# EAGLE design sandwich_tb55_5 (EAGLE 5.10)
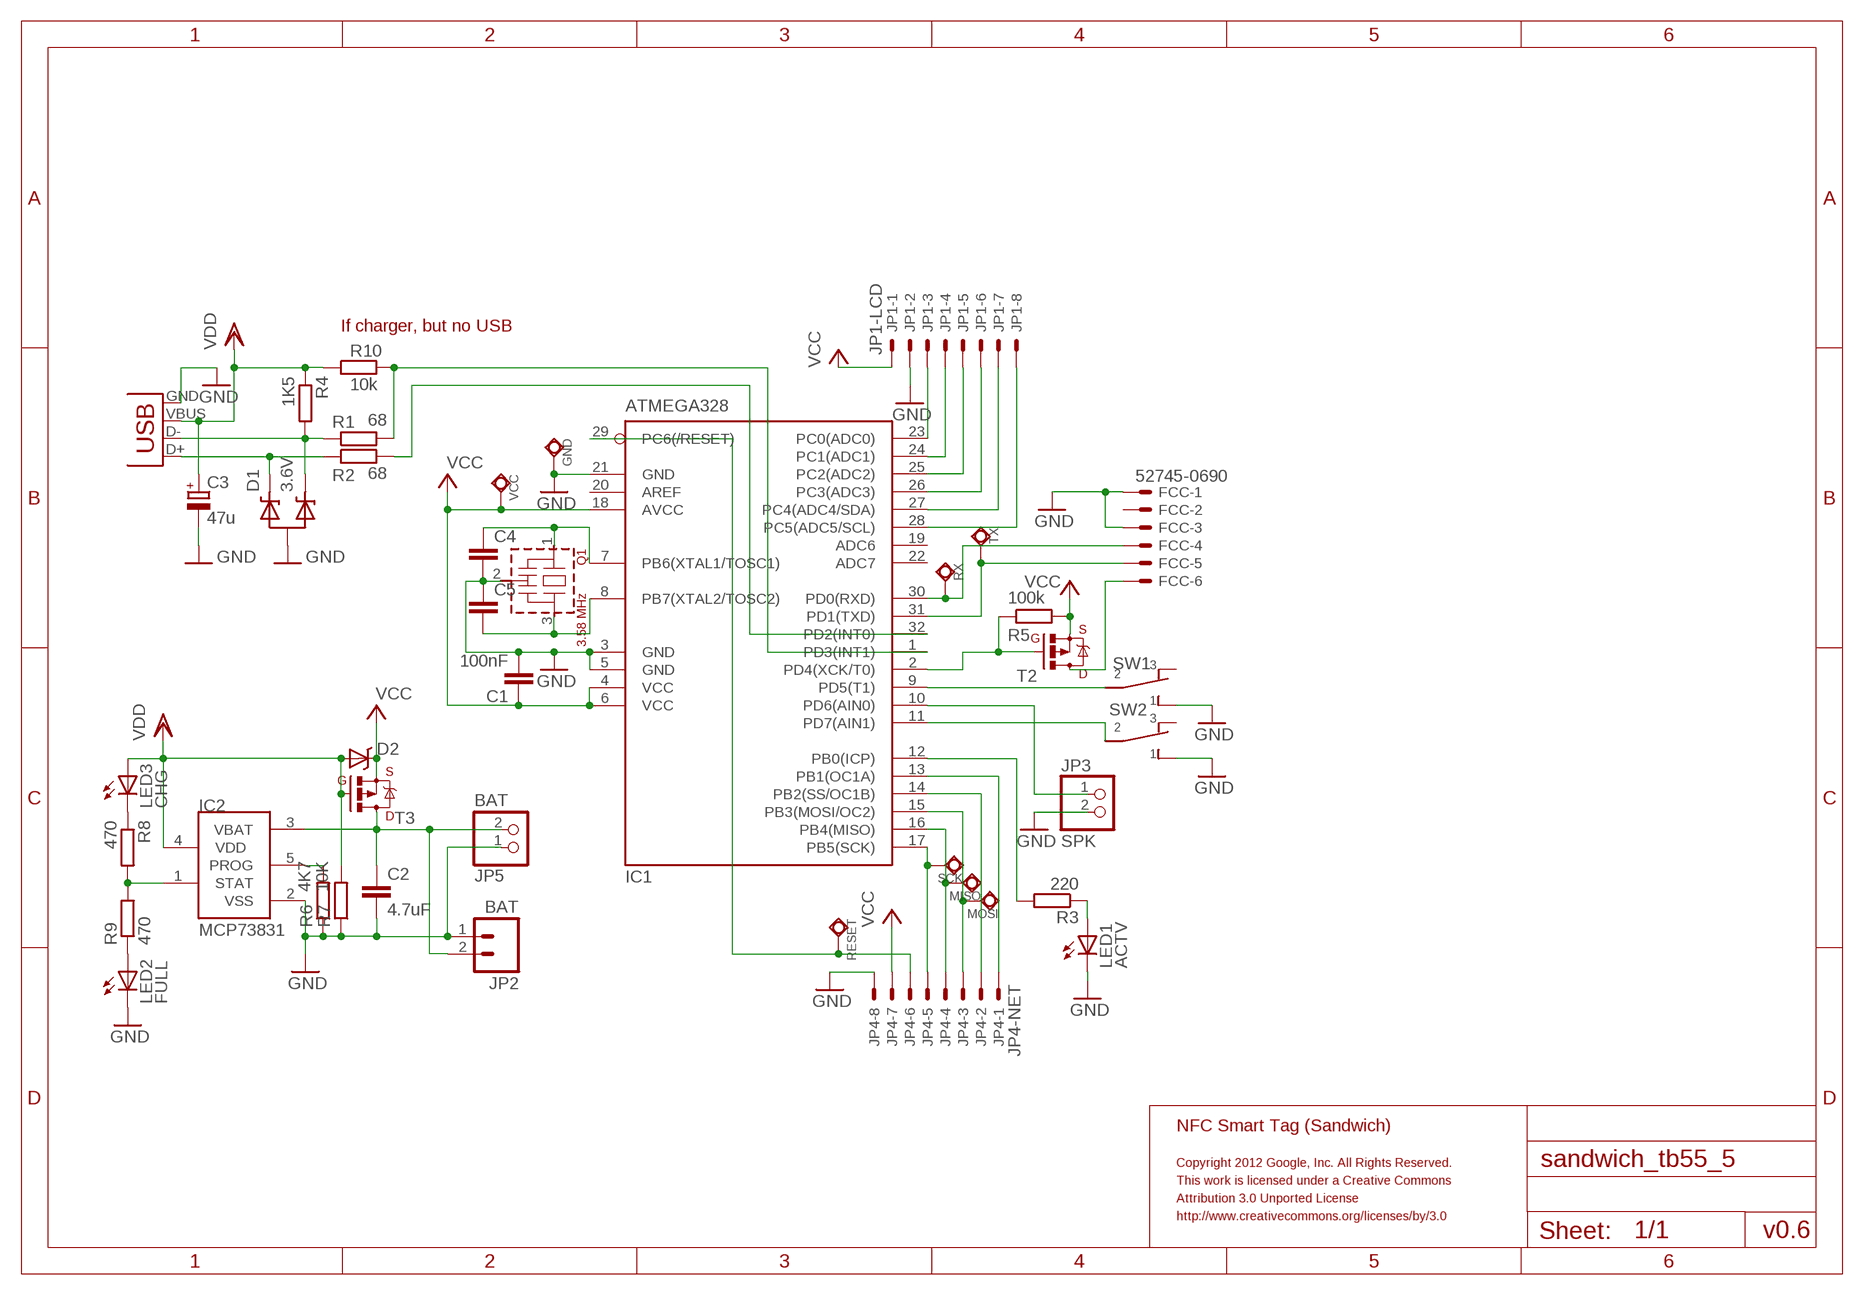
[diagram p0: schematic, sheet 1]

## Parts
C1  100nF  CAP0805  [0805]
C2  4.7uF  C-EUC0805  [C0805]
C3  47u  CPOL-EUCT6032  [CT6032]
C4  CAP0603-CAP  [0603-CAP]
C5  CAP0603-CAP  [0603-CAP]
D1  3.6V  DIODE-ZENER-DUAL-COMMON-ANODE  [SOT23]
D2  DIODE-SCHOTTKY  [MCPH3]
FCC  52745-0690  [52745-0690]
GND  TESTPOINT-BOTTOM  [TP_BOTTOM]
IC1  ATMEGA328  MEGA8-AI  [TQFP32-08]
IC2  MCP73831  [SOT23-5L]
JP1  JP1-LCD  53261-08  [53261-08]
JP2  BAT  M02-JST-2MM-SMT  [S2B-PH]
JP3  SPK  PINHD-1X2  [1X02]
JP4  JP4-NET  53261-08  [53261-08]
JP5  BAT  PINHD-1X2  [1X02]
LED1  ACTV  LEDCHIP-LED0805  [CHIP-LED0805]
LED2  FULL  LEDCHIP-LED0805  [CHIP-LED0805]
LED3  CHG  LEDCHIP-LED0805  [CHIP-LED0805]
MISO  TESTPOINT-BOTTOM  [TP_BOTTOM]
MOSI  TESTPOINT-BOTTOM  [TP_BOTTOM]
Q1  3.58 MHz  CTSC  [CSTCC_MG]
R1  68  R-EU_R0805  [R0805]
R2  68  R-EU_R0805  [R0805]
R3  220  R-EU_R0805  [R0805]
R4  1K5  R-EU_R0805  [R0805]
R5  100k  R-EU_R0805  [R0805]
R6  4K7  R-EU_R0805  [R0805]
R7  10K  R-EU_R0805  [R0805]
R8  470  R-EU_R0805  [R0805]
R9  470  R-EU_R0805  [R0805]
R10  10k  R-EU_R0805  [R0805]
RESET  TESTPOINT-BOTTOM  [TP_BOTTOM]
RX  TESTPOINT-BOTTOM  [TP_BOTTOM]
SCK  TESTPOINT-BOTTOM  [TP_BOTTOM]
SW1  SWITCH-CUS-12B  [CUS-12B]
SW2  SWITCH-CUS-12B  [CUS-12B]
T2  MOSFET-PCHANNEL  [SOT23]
T3  MOSFET-PCHANNEL  [SOT23]
TX  TESTPOINT-BOTTOM  [TP_BOTTOM]
USB  USB-MICROB  [USB-MICROB]
VCC  TESTPOINT-BOTTOM  [TP_BOTTOM]

## Nets
D+: D1.2(C2) R2.1 USB.D+
D-: D1.1(C1) R1.1 R4.2 USB.D-
GND: C1.2 C2.2 C3.- C4.2 C5.1 D1.3(A) FCC.1 FCC.3 GND.TP IC1.3(GND) IC1.5(GND) IC1.21(GND) IC2.2(VSS) JP1.2 JP2.1 JP3.2 JP4.8 JP5.1 LED1.C LED2.C Q1.2(VSS) R6.1 R7.1 SW1.1 SW2.1 USB.GND
N$1: LED3.C R8.1
N$2: LED2.A R9.1
N$7: LED1.A R3.1
NFC_VCC: FCC.6 T2.3(D)
PB0: IC1.12(PB0(ICP)) R3.2
PB1: IC1.13(PB1(OC1A)) JP4.1
PB2: IC1.14(PB2(SS/OC1B)) JP4.2
PB3: IC1.15(PB3(MOSI/OC2)) JP4.3 MOSI.TP
PB4: IC1.16(PB4(MISO)) JP4.4 MISO.TP
PB5: IC1.17(PB5(SCK)) JP4.5 SCK.TP
PC0: IC1.23(PC0(ADC0)) JP1.3
PC1: IC1.24(PC1(ADC1)) JP1.4
PC2: IC1.25(PC2(ADC2)) JP1.5
PC3: IC1.26(PC3(ADC3)) JP1.6
PC4: IC1.27(PC4(ADC4/SDA)) JP1.7
PC5: IC1.28(PC5(ADC5/SCL)) JP1.8
PD2: IC1.32(PD2(INT0)) R2.2
PD3: IC1.1(PD3(INT1)) R1.2 R10.2
PD4: IC1.2(PD4(XCK/T0)) R5.1 T2.1(G)
PD5: IC1.9(PD5(T1)) SW1.2
PD6: IC1.10(PD6(AIN0)) JP3.1
PD7: IC1.11(PD7(AIN1)) SW2.2
PROG: IC2.5(PROG) R6.2
RESET: IC1.29(PC6(/RESET)) JP4.6 RESET.TP
RX: FCC.4 IC1.30(PD0(RXD)) RX.TP
STAT: IC2.1(STAT) R8.2 R9.2
TX: FCC.5 IC1.31(PD1(TXD)) TX.TP
VBAT: C2.1 IC2.3(VBAT) JP2.2 JP5.2 T3.3(D)
VCC: C1.1 D2.3(C) IC1.4(VCC) IC1.6(VCC) IC1.18(AVCC) JP1.1 JP4.7 R5.2 T2.2(S) T3.2(S) VCC.TP
VDD: C3.+ D2.1(A) IC2.4(VDD) LED3.A R4.1 R7.2 R10.1 T3.1(G) USB.VBUS
XTAL1: C4.1 IC1.7(PB6(XTAL1/TOSC1)) Q1.1
XTAL2: C5.2 IC1.8(PB7(XTAL2/TOSC2)) Q1.3
Unconnected: FCC.2 IC1.19(ADC6) IC1.20(AREF) IC1.22(ADC7) SW1.3 SW2.3

## Notes on the sheet
- If charger, but no USB
- NFC Smart Tag (Sandwich)
- Copyright 2012 Google, Inc. All Rights Reserved.
- This work is licensed under a Creative Commons
- Attribution 3.0 Unported License
- http://www.creativecommons.org/licenses/by/3.0
- v0.6

## Library data of the parts
C1 C4 C5 = SparkFun:CAP: Capacitor Standard 0603 ceramic capacitor, and 0.1" leaded capacitor.
C2 = resistor:C-EU: CAPACITOR, European symbol
C3 = rcl:CPOL-EU: POLARIZED CAPACITOR, European symbol
D1 = sandwich:DIODE-ZENER-DUAL-COMMON-ANODE: Dual Zener diode in SOT-23 Package. e.g. AZ23C
D2 = sandwich:DIODE-SCHOTTKY
FCC = con-molex:52745-0690: FFC/FPC-to-Board 0.50mm (.020") SMT Top Contact Right Angle, ZIF, Style Receptacle 52745 / 52435 Source: http://www.molex.com/product/ffc/52745.html; MPN: 52745-0690; OC_FARNELL: unknown; OC_NEWARK: 92M6374
GND MISO MOSI RESET RX SCK TX VCC = sandwich:TESTPOINT-BOTTOM: Round test point on bototm layer. 1.5mm diameter
IC1 = atmel:MEGA8: MICROCONTROLLER 8 Kbytes FLASH, 1 kbytes SRAM, 512 bytes EEPROM, USART, 6-channel 10 bit ADC, 2-channel 8 bit ADC Pin compatible with Atmega48, ATMega88, ATMega168 Source: avr.lbr; MPN: ATMEGA8-16AU; OC_FARNELL: 9171371; OC_NEWARK: 73M8863
IC2 = microchip-update-2:MCP73831: Miniature Single-Cell, Fully Integrated Li-Ion, Li-Polymer Charge Management Controllers
JP1 JP4 = con-molex:53?-08: CONNECTOR wire to board 1.25 mm (.049 inch) pitch header; OC_FARNELL: 1125376; OC_NEWARK: unknown
JP2 = SparkFun:M02: Header 2 Standard 2-pin 0.1" header. Use with straight break away headers (SKU : PRT-00116), right angle break away headers (PRT-00553), swiss pins (PRT-00743), machine pins (PRT-00117), and female headers (PRT-00115). Molex polarized connector foot print use with SKU : PRT-08233 with associated crimp pins and housings.
JP3 JP5 = pinhead:PINHD-1X2: PIN HEADER
LED1-LED3 = led:LED: LED OSRAM: - CHIPLED LG R971, LG N971, LY N971, LG Q971, LY Q971, LO R971, LY R971 LH N974, LH R974 LS Q976, LO Q976, LY Q976 LO Q996 - Hyper CHIPLED LW Q18S LB Q993, LB Q99A, LB R99A - SideLED LS A670, LO A670, LY A670, LG A670, LP A670 LB A673, LV A673, LT A673, LW A673 LH A674 LY A675 LS A676, LA A676, LO A676, LY A676, LW A676 LS A679, LY A679, LG A679 - Hyper Micro SIDELED® LS Y876, LA Y876, LO Y876, LY Y876 LT Y87S - SmartLED LW L88C, LW L88S LB L89C, LB L89S, LG L890 LS L89K, LO L89K, LY L89K LS L896, LA L896, LO L896, LY L896 - TOPLED LS T670, LO T670, LY T670, LG T670, LP T670 LSG T670, LSP T670, LSY T670, LOP T670, LYG T670 LG T671, LOG T671, LSG T671 LB T673, LV T673, LT T673, LW T673 LH T674 LS T676, LA T676, LO T676, LY T676, LB T676, LH T676, LSB T676, LW T676 LB T67C, LV T67C, LT T67C, LS T67K, LO T67K, LY T67K, LW E67C LS E67B, LA E67B, LO E67B, LY E67B, LB E67C, LV E67C, LT E67C LW T67C LS T679, LY T679, LG T679 LS T770, LO T770, LY T770, LG T770, LP T770 LB T773, LV T773, LT T773, LW T773 LH T774 LS E675, LA E675, LY E675, LS T675 LS T776, LA T776, LO T776, LY T776, LB T776 LHGB T686 LT T68C, LB T68C - Hyper Mini TOPLED® LB M676 - Mini TOPLED Santana® LG M470 LS M47K, LO M47K, LY M47K Source: http://www.osram.convergy.de LUXEON: - LUMILED® LXK2-PW12-R00, LXK2-PW12-S00, LXK2-PW14-U00, LXK2-PW14-V00 LXK2-PM12-R00, LXK2-PM12-S00, LXK2-PM14-U00 LXK2-PE12-Q00, LXK2-PE12-R00, LXK2-PE12-S00, LXK2-PE14-T00, LXK2-PE14-U00 LXK2-PB12-K00, LXK2-PB12-L00, LXK2-PB12-M00, LXK2-PB14-N00, LXK2-PB14-P00, LXK2-PB14-Q00 LXK2-PR12-L00, LXK2-PR12-M00, LXK2-PR14-Q00, LXK2-PR14-R00 LXK2-PD12-Q00, LXK2-PD12-R00, LXK2-PD12-S00 LXK2-PH12-R00, LXK2-PH12-S00 LXK2-PL12-P00, LXK2-PL12-Q00, LXK2-PL12-R00 Source: www.luxeon.com KINGBRIGHT: KA-3528ASYC Source: www.kingbright.com
Q1 = murata-resonators:CTSC: Murata Resonator 3.50 - 10.00MHz
R1-R10 = resistor:R-EU_: RESISTOR, European symbol
SW1 SW2 = sandwich:SWITCH-CUS-12B: CUS-12B 1P2T SMD Switch RS Part 602-3633
T2 T3 = sandwich:MOSFET-PCHANNEL: E.g. IRLML6402
USB = sandwich:USB: USB Connectors USB-B-PTH is fully proven SKU : PRT-00139 USB-miniB is fully proven SKU : PRT-00587 USB-A-PCB is untested. USB-A-H is throughly reviewed, but untested. Spark Fun Electronics SKU : PRT-00437 USB-B-SMT is throughly reviewed, but untested. Needs silkscreen touching up. USB-A-S has not been used/tested USB-MB-H has not been used/tested

## Board
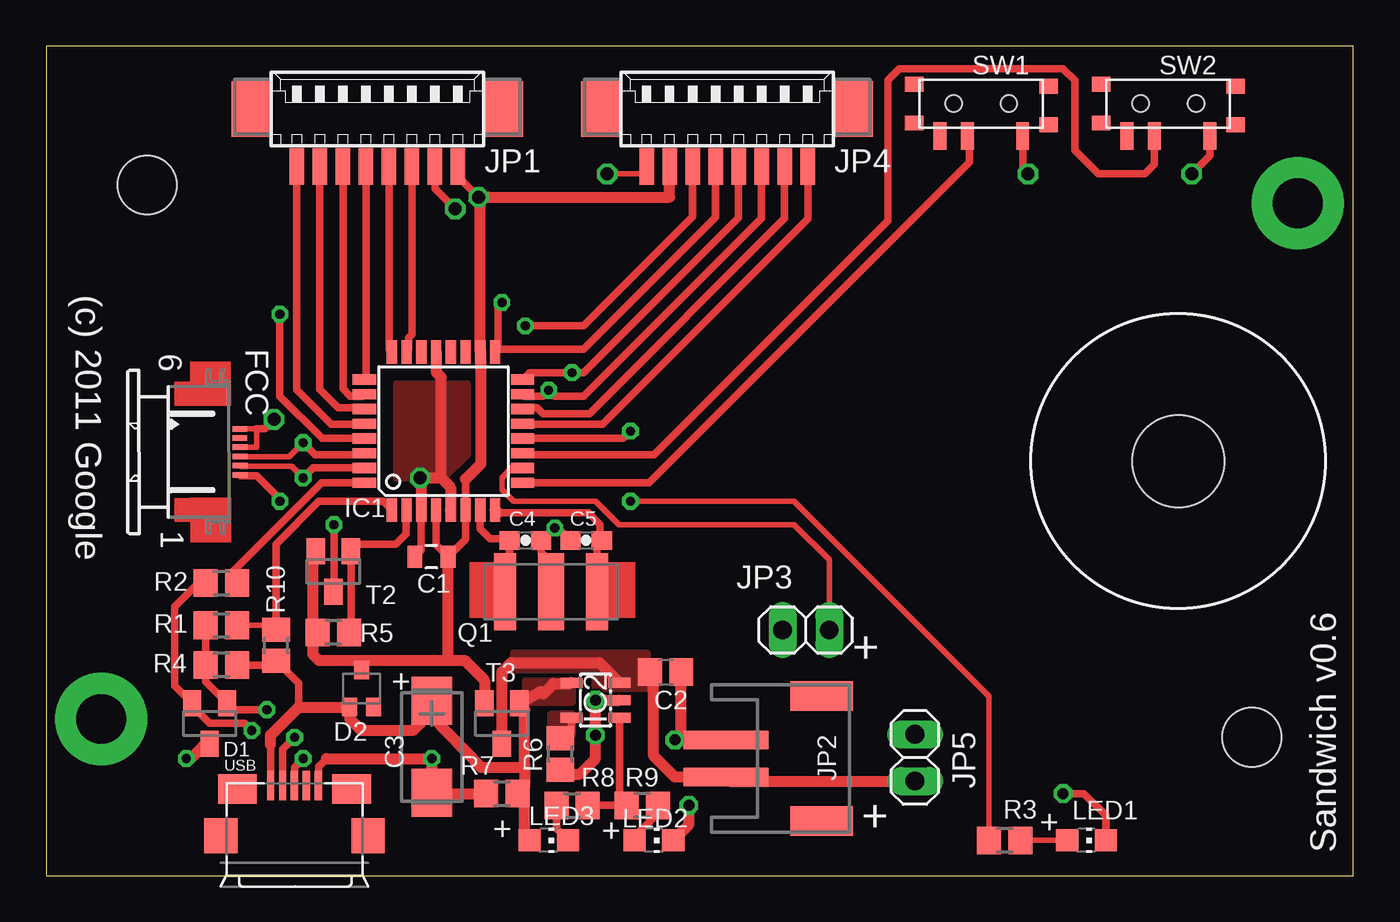
[diagram p1: board, top side]
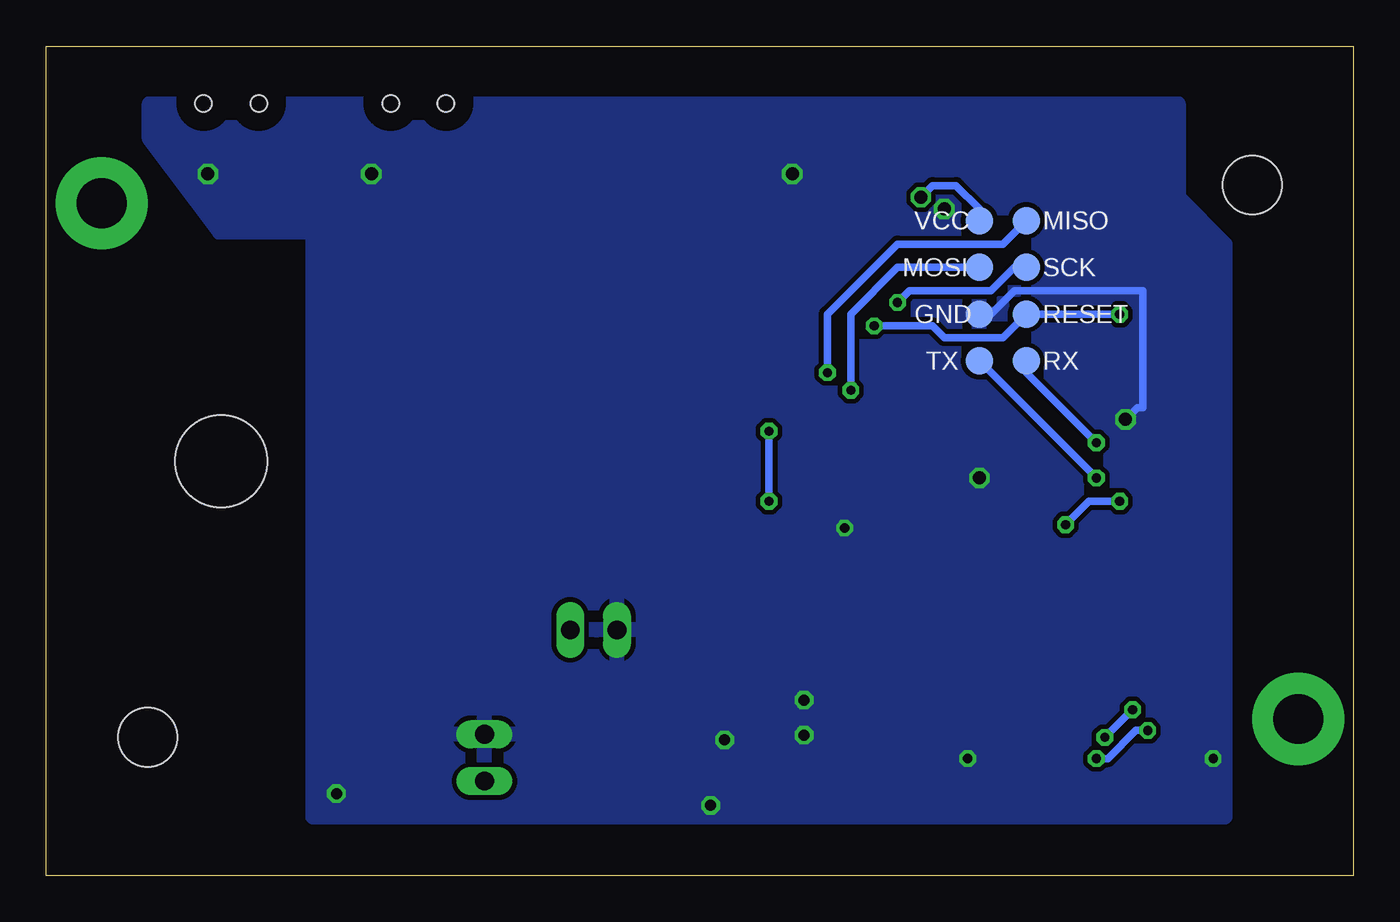
[diagram p2: board, bottom side, seen from below]

Size 71.02 x 45.04 mm. Coordinates in mm from the lower left corner, seen from the top.
Outline: 0,0 71.02,0 71.02,45.04 0,45.04 0,0
Copper layers (1*16): Top 0.035mm / dielectric 1.5mm / Bottom 0.035mm
Design rules "default *": minimum track width 0.3mm, minimum drill 19mil, track to track 5mil, track to pad 5mil, pad to pad 5mil, via to via 5mil, smd to smd 5mil, copper to edge 40mil, drill to drill 5mil, minimum pad ring 10mil, minimum via ring 8mil, stop-mask expansion 4mil, vias tented up to drill 0.5mm, thermal gap 10mil
Holes 3.2 mm at 5.5,37.5 65.5,7.5
Holes 5 mm at 61.5,22.5

### Footprints (pad centres in the part's own frame; a part is rotated, then mirrored left to right if it is on the bottom)
0805 = smd 0.8 x 1.2: 1 -0.9,0; 2 0.9,0
C0805 = smd 1.3 x 1.5: 1 -0.85,0; 2 0.85,0
CT6032 = smd 2.6 x 2.2: + -2.5,0; - 2.5,0
0603-CAP = smd 1.1 x 1: 1 -0.85,0; 2 0.85,0
SOT23 = smd 1 x 1.4: 1 -0.95,-1.1; 2 0.95,-1.1; 3 0,1.1
MCPH3 = smd 0.8 x 1: 1 -0.65,-1; 2 0.65,-1; 3 0,1
52745-0690 = smd 0.3 x 0.8: 1 -1.25,2.5; 2 -0.75,2.5; 3 -0.25,2.5; 4 0.25,2.5; 5 0.75,2.5; 6 1.25,2.5
TP_BOTTOM = smd 1.5 x 1.5 bottom: TP 0,0
TQFP32-08 = smd 1.27 x 0.559: 1 -4.293,2.8; 2 -4.293,2; 3 -4.293,1.2; 4 -4.293,0.4; 5 -4.293,-0.4; 6 -4.293,-1.2; 7 -4.293,-2; 8 -4.293,-2.8; 17 4.293,-2.8; 18 4.293,-2; 19 4.293,-1.2; 20 4.293,-0.4; 21 4.293,0.4; 22 4.293,1.2; 23 4.293,2; 24 4.293,2.8 | smd 0.559 x 1.27: 9 -2.8,-4.293; 10 -2,-4.293; 11 -1.2,-4.293; 12 -0.4,-4.293; 13 0.4,-4.293; 14 1.2,-4.293; 15 2,-4.293; 16 2.8,-4.293; 25 2.8,4.293; 26 2,4.293; 27 1.2,4.293; 28 0.4,4.293; 29 -0.4,4.293; 30 -1.2,4.293; 31 -2,4.293; 32 -2.8,4.293
SOT23-5L = smd 0.55 x 1.2: 1 -0.95,-1.3; 2 0,-1.3; 3 0.95,-1.3; 4 0.95,1.3; 5 -0.95,1.3
53261-08 = smd 0.8 x 2: 1 4.375,-2.5; 2 3.125,-2.5; 3 1.875,-2.5; 4 0.625,-2.5; 5 -0.625,-2.5; 6 -1.875,-2.5; 7 -3.125,-2.5; 8 -4.375,-2.5 | smd 2.1 x 3: S1 6.875,0.625; S2 -6.875,0.625
S2B-PH = smd 1 x 4.6: 1 -1,-3.7; 2 1,-3.7 | smd 1.6 x 3.4: NC1 -3.4,1.5; NC2 3.4,1.5
1X02 = drill 1.016 long: 1 -1.27,0; 2 1.27,0
CHIP-LED0805 = smd 1.2 x 1.2: A 0,-1.05; C 0,1.05
CSTCC_MG = smd 1.2 x 4.2: 1 -2.5,0; 3 2.5,0 | smd 1.4 x 4.2: 2 0,0
R0805 = smd 1.3 x 1.5: 1 -0.85,0; 2 0.85,0
CUS-12B = smd 0.7 x 1.5: 1 -2.25,1.75; 2 0.75,1.75; 3 2.25,1.75 | smd 1 x 0.8: P$1 3.65,1.05; P$2 3.65,-1.05; P$3 -3.65,1.15; P$4 -3.65,-0.95 | hole 0.9: 1.5,0; -1.5,0
USB-MICROB = smd 0.4 x 1.6: D+ 0,2.9; D- -0.65,2.9; GND 1.3,2.9; ID 0.65,2.9; VBUS -1.3,2.9 | smd 2.1 x 1.6: GND@1 3.1,2.7; GND@4 -3.1,2.7 | smd 1.8 x 1.9: GND@2 -4,0.15; GND@3 4,0.15

### Placement (x,y rotation side)
C1  20.93,17.31 180 top
C2  33.66,11.05 0 top
C3  20.95,6.99 270 top
C4  26.04,18.2 0 top
C5  29.34,18.2 0 top
D1  8.89,8.26 180 top
D2  17.14,10.16 0 top
FCC  8.04,23 270.1 top
GND  20.32,30.48 0 top
IC1  21.59,24.13 90 top
IC2  29.84,9.53 90 top
JP1  18,41 0 top
JP2  40.64,6.35 270 top
JP3  41.27,13.34 180 top
JP4  37,41 0 top
JP5  47.2,6.4 270 top
LED1  56.52,1.91 270 top
LED2  33.02,1.91 270 top
LED3  27.3,1.91 270 top
MISO  17.78,35.56 0 top
MOSI  20.32,33.02 0 top
Q1  27.43,15.4 0 top
R1  9.53,13.59 0 top
R2  9.53,15.88 0 top
R3  52.07,1.91 180 top
R4  9.53,11.43 180 top
R5  15.61,13.2 180 top
R6  27.94,6.6 90 top
R7  24.77,4.45 0 top
R8  28.57,3.81 0 top
R9  32.38,3.81 180 top
R10  12.5,12.5 90 top
RESET  17.78,30.48 0 top
RX  17.78,27.94 0 top
SCK  17.78,33.02 0 top
SW1  50.8,41.91 180 top
SW2  60.96,41.91 180 top
T2  15.61,16.51 180 top
T3  24.77,8.26 180 top
TX  20.32,27.94 0 top
USB  13.5,2 0 top
VCC  20.32,35.56 0 top

### Tracks (layer width: path | path; a pad name or v marks a point on that pad's centre or on a via)
D+  (via drill 0.5, 0.5 pad 0.41)
  Top 0.406: USB.D+ 13.5,5.88 v13.97,6.35 | R2.1 8.26,15.88 6.99,14.61 6.99,10.31 D1.2 7.94,9.21 8.89,8.26 10.79,8.26 v11.18,7.87
  Bottom 0.406: v11.18,7.87 11.81,7.87 13.34,6.35 v13.97,6.35
D-  (via drill 0.5)
  Top 0.406: R1.1 R4.2 8.68,10.52 D1.1 10.2,9 v12,9 | USB.D- 12.85,6.85 v13.5,7.5
  Bottom 0.406: v12,9 v13.5,7.5
GND  (via drill 0.5, 0.6, 0.7)
  Top 0.305: FCC.1 11.45,24.25 11.45,23.25 FCC.3 | JP4.8 32.62,38.34 32.38,38.1 v30.48,38.1
  Top 0.406: SW1.1 53.05,38.39 v53.34,38.1 | SW2.1 63.21,39.08 v62.23,38.1 | 20.39,21.52 v20.32,21.59 | 21.97,19.86 IC1.5 | JP1.2 21.12,37.3 v22.23,36.2 | 11.45,24.25 11.87,24.25 v12.38,24.77 | IC1.3 20.38,19.77 20.38,17.66 C1.2 | USB.GND 14.8,5.91 15.24,6.35 | 20.95,5.08 21.17,5.29 | LED1.C 57.56,3.27 56.39,4.45 v55.24,4.45 | 28.41,18.29 C5.1 27.83,18.87 v27.64,18.87 27.09,18.32 27,18.32 C4.2 26.89,17.57 27.94,16.51 27.94,15.91 Q1.2
  Top 0.61: IC1.3 20.39,21.52 | v20.32,21.59 21.46,21.59 | 21.46,21.59 21.97,21.08 21.97,19.86 | 21.46,21.59 21.46,27.05 21.21,27.3 21.21,28.4 IC1.21 | 15.24,6.35 v20.95,6.35 20.95,5.08 C3.- 21,4.45 R7.1 | IC2.2 v29.84,9.53 v29.84,7.62 29.84,6.34 29,5.5 28.19,5.5 R6.1 | 34.18,7.35 JP2.1 | C2.2 34.51,7.71 v34.16,7.37 | v7.62,6.35 7.85,6.35 8.5,7 8.73,7 D1.3 | v34.92,3.81 34.92,2.76 LED2.C
  Top 0.813: v34.16,7.37 34.18,7.35
  Bottom 0.406: GND.TP 19.68,30.48 18.41,31.75 11.43,31.75 11.43,25.4 11.75,25.4 v12.38,24.77
  pour Bottom (isolate 0.254): 56.52,3.17 56.52,34.92 61.59,34.92 65.41,40.01 65.41,41.91 9.53,41.91 9.53,36.83 6.99,34.29 6.99,3.17
  pour Top: 19.05,26.67 22.86,26.67 22.86,22.86 21.59,21.59 19.05,21.59
N$1
  Top 0.406: R8.1 27.73,2.54 LED3.C
N$2
  Top 0.406: LED2.A 31.97,2.12 33.02,3.17 33.02,3.6 R9.1
N$7
  Top 0.305: R3.1 LED1.A
N$18  (via drill 2.7 pad 5)
  other vias: 68,36.5
N$20  (via drill 2.7 pad 5)
  other vias: 3,8.5
NFC_VCC  (via drill 0.5)
  Top 0.305: 10.58,21.72 FCC.6
  Top 0.406: v12.7,20.32 12.7,20.45 11.43,21.72 10.58,21.72 | v15.64,19.05 15.64,15.44 T2.3
  Bottom 0.406: v12.7,20.32 14.37,20.32 v15.64,19.05
PB0  (via drill 0.5)
  Top 0.305: v31.75,20.32 40.64,20.32 51.22,9.74 R3.2
  Top 0.406: IC1.12 31.35,23.73 v31.75,24.13
  Bottom 0.406: v31.75,24.13 v31.75,20.32
PB1
  Top 0.406: JP4.1 41.38,35.66 30.23,24.51 26.12,24.51 IC1.13
PB2
  Top 0.406: JP4.2 40.12,35.68 29.53,25.08 26.99,25.08 26.67,25.4 25.95,25.4 IC1.14
PB3  (via drill 0.5)
  Top 0.406: JP4.3 38.88,35.7 29.21,26.04 27.62,26.04 v27.3,26.35 26.99,26.04 25.98,26.04 IC1.15
  Bottom 0.406: MOSI.TP 24.77,33.02 27.3,30.48 v27.3,26.35
PB4  (via drill 0.5)
  Top 0.406: JP4.4 37.62,35.72 29.21,27.3 v28.57,27.3 26.26,27.3 IC1.16
  Bottom 0.406: MISO.TP 19.05,34.29 24.77,34.29 28.57,30.48 v28.57,27.3
PB5  (via drill 0.5)
  Top 0.406: JP4.5 36.38,35.74 29.21,28.57 24.54,28.57 | 24.54,28.57 IC1.17 | 24.54,28.57 24.54,30.89 v24.77,31.11
  Bottom 0.406: v24.77,31.11 24.13,31.75 19.68,31.75 18.41,33.02 SCK.TP
PC0
  Top 0.406: JP1.3 19.88,29.4 19.68,29.21 19.68,28.52 IC1.23
PC1
  Top 0.406: JP1.4 18.62,28.59 IC1.24
PC2
  Top 0.305: IC1.25 17.38,27.01
  Top 0.406: 17.38,27.01 JP1.5
PC3
  Top 0.305: IC1.26 17.2,26.04
  Top 0.406: JP1.6 16.12,26.42 16.51,26.04 17.2,26.04
PC4
  Top 0.305: IC1.27 17.23,25.4
  Top 0.406: JP1.7 14.88,26.4 15.88,25.4 17.23,25.4
PC5
  Top 0.305: IC1.28 17.06,24.51
  Top 0.406: JP1.8 13.62,26.38 15.49,24.51 17.06,24.51
PD2
  Top 0.406: IC1.32 14.98,21.33 10.16,16.51 10.16,16.09 R2.2
PD3
  Top 0.305: R1.2 12.26,13.59 R10.2
  Top 0.406: IC1.1 18.31,20.32 14.82,20.32 12.5,18 R10.2
PD4
  Top 0.406: IC1.2 19.56,19.8 19.56,18.56 19,18 16.95,18 T2.1 16.56,13.3 R5.1 16.06,12.8
PD5
  Top 0.406: IC1.9 32.76,21.33 50.16,38.73 50.16,40.05 SW1.2
PD6
  Top 0.305: 25.4,22.23 24.77,21.59 24.77,20.95 25.4,20.32 29.84,20.32 31.11,19.05 40.64,19.05 42.55,17.14 JP3.1
  Top 0.406: 25.4,22.23 25.79,22.23 IC1.10
PD7
  Top 0.406: SW2.2 60.21,38.62 59.69,38.1 57.15,38.1 55.88,39.37 55.88,43.18 55.24,43.81 46.35,43.81 45.72,43.18 45.72,35.56 33.02,22.86 25.95,22.86 IC1.11
PROG
  Top 0.406: IC2.5 28.55,7.87
  pour Top (no thermals): 28.57,8.76 27.43,8.76 27.43,7.62 28.57,7.62
RESET  (via drill 0.5)
  Top 0.305: JP4.6 35.25,38.38
  Top 0.406: IC1.29 15.01,23.73 12.7,26.04 v12.7,30.48 | 34.92,38.7 JP4.6 35.12,35.76 29.21,29.84 v26.04,29.84
  Bottom 0.406: v12.7,30.48 RESET.TP 19.05,29.21 22.23,29.21 22.86,29.84 v26.04,29.84
RX  (via drill 0.5)
  Top 0.305: v13.97,23.5 13.21,22.73 10.56,22.73 FCC.4
  Top 0.406: IC1.30 17.23,22.86 14.61,22.86 v13.97,23.5
  Bottom 0.406: RX.TP 17.78,27.3 v13.97,23.5
STAT
  Top 0.406: R8.2 R9.2 | R9.2 31.75,4.03 | IC2.1 31.14,4.2 R9.2
TX  (via drill 0.5)
  Top 0.305: 10.56,22.23 FCC.5 10.57,22.23 13.34,22.23 v13.97,21.59
  Top 0.406: IC1.31 14.51,22.13 v13.97,21.59
  Bottom 0.406: v13.97,21.59 TX.TP
VBAT
  Top 0.61: T3.3 24.77,11.05 25.27,11.56 30.06,11.56 IC2.3 | C2.1 33,10.85 33,6.5 34.15,5.35 JP2.2 37.16,5.13 JP5.2
  pour Top (no thermals): 32.64,10.16 29.84,10.16 29.84,11.18 25.4,11.18 25.4,12.06 32.64,12.06
VCC  (via drill 0.7)
  Top 0.305: 16.98,11 16.98,11.66 17,11.68
  Top 0.406: 22.79,21.52 IC1.6 22.79,18.27 C1.1 21.19,17.95 IC1.4 | R5.2 14.66,13.3 | 16.98,11 D2.3 | 23.59,36.42 24,36.83 | JP1.1 22.38,37.95 v23.5,36.83
  Top 0.61: JP4.7 33.88,36.83 24,36.83 v23.5,36.83 23.59,36.73 | T3.2 23.82,10.6 22.74,11.68 21.84,11.68 | D2.3 17.16,11.18 | 22.79,21.52 23.62,22.35 23.62,28.45 IC1.18 23.59,36.42 | 21.84,11.68 C1.1 | T2.2 14.66,17.16 14.5,17 14.5,13.46 R5.2 14.5,12.94 14.5,12 14.82,11.68 17,11.68 21.84,11.68
  Bottom 0.406: v23.5,36.83 22.86,37.47 21.59,37.47 20.32,36.2 VCC.TP
VDD
  Top 0.406: USB.VBUS 12.19,7.11 | R4.1 12.28,11.43 R10.1 13.72,10.43 13.72,9.14
  Top 0.61: 12.19,7.11 12.19,7.62 13.72,9.14 16.48,9.14 D2.1 | IC2.4 28.48,10.41 27.56,10.41 26.99,9.84 26.84,9.99 T3.1 | T3.1 25.71,9.21 25.79,9.21 26,9 26,6 | R7.2 25.98,4.45 25.98,2.18 LED3.A | R7.2 25.61,4.51 25.9,4.8 | T3.1 25.9,9.17 | D2.1 16.51,9.14 | 26,6 26,4.83 R7.2 | 26,6 25.97,5.87 23.62,5.87 20.95,8.64 C3.+ 20.32,8.85 20.32,8.26 19.94,7.87 17.13,7.87 16.5,8.5 D2.1
  pour Top (no thermals): 28.57,10.54 28.57,9.4 26.04,9.4 26.04,10.54
XTAL1
  Top 0.406: IC1.7 23.59,18.83 24.13,18.29 25.1,18.29 C4.1 25.18,15.65 Q1.1
XTAL2
  Top 0.406: Q1.3 29.93,17.94 C5.2 30.1,18.3 30.1,19.05 29.46,19.68 24.54,19.68
  Top 0.61: IC1.8 24.54,19.68
(copper drawn outside any net)
  shapes: Top area x2

### Text on the board
tPlace: (c) 2011 Google | Sandwich v0.6
tNames: 6 | 1 | + | + | + | + | + | +